# EAGLE design Line Follower (EAGLE 6.1)
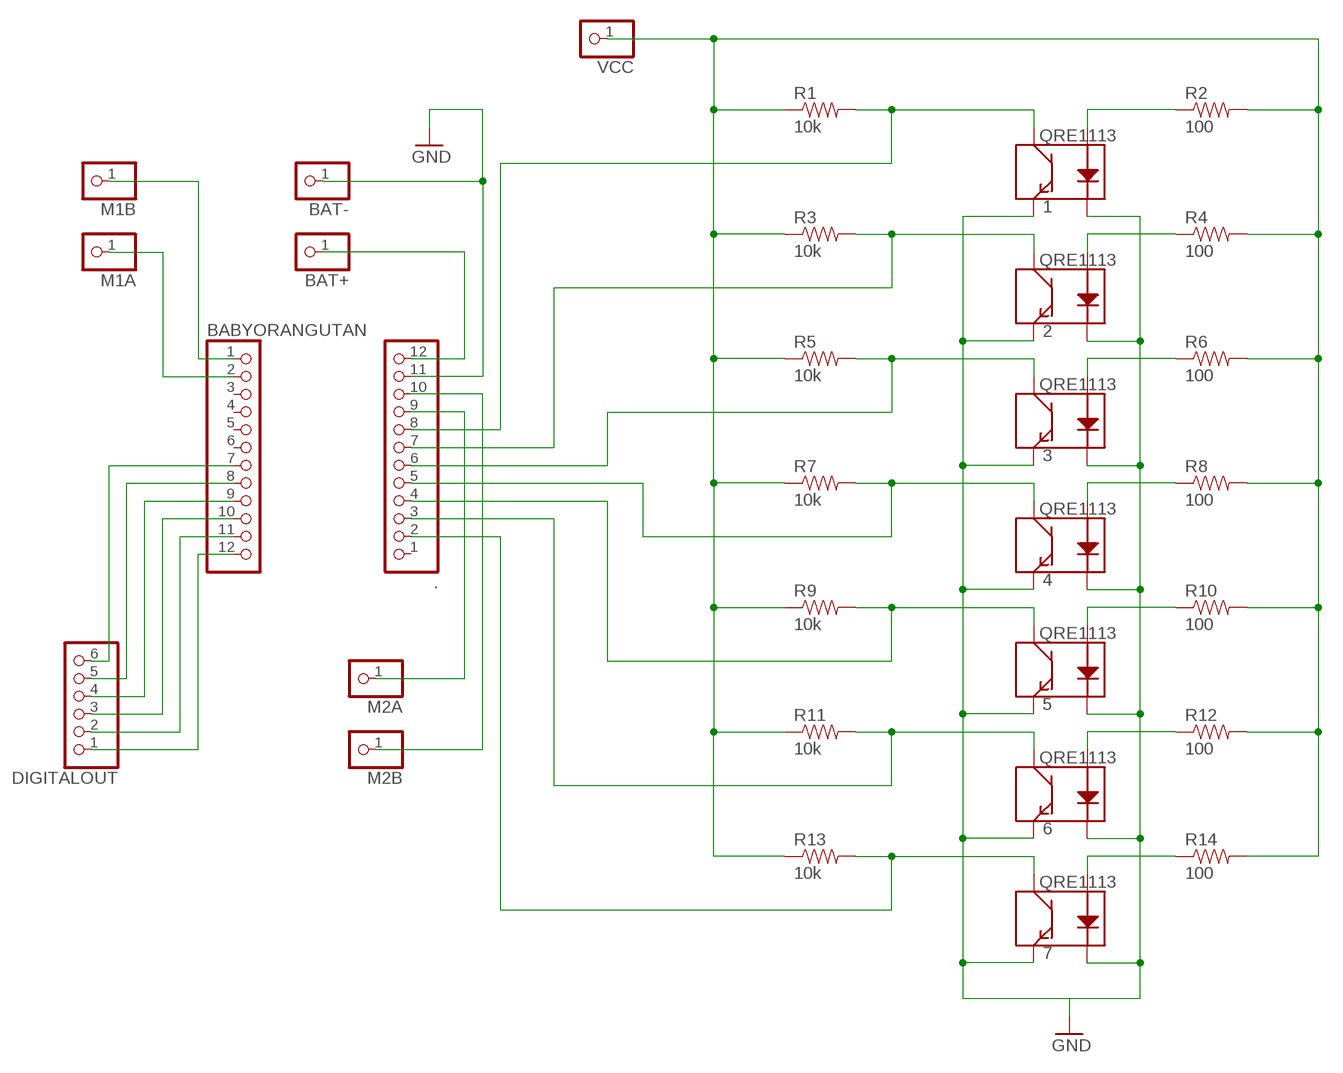
[diagram p0: schematic, sheet 1]

## Parts
1  QRE1113  [QRE1113]
2  QRE1113  [QRE1113]
3  QRE1113  [QRE1113]
4  QRE1113  [QRE1113]
5  QRE1113  [QRE1113]
6  QRE1113  [QRE1113]
7  QRE1113  [QRE1113]
.  PINHD-1X12  [1X12]
BABYORANGUTAN  PINHD-1X12  [1X12]
BAT+  PINHD-1X1  [1X01]
BAT-  PINHD-1X1  [1X01]
DIGITALOUT  PINHD-1X6  [1X06]
M1A  PINHD-1X1  [1X01]
M1B  PINHD-1X1  [1X01]
M2A  PINHD-1X1  [1X01]
M2B  PINHD-1X1  [1X01]
R1  10k  RESISTOR0603-RES  [0603-RES]
R2  100  RESISTOR0805-RES  [0805]
R3  10k  RESISTOR0603-RES  [0603-RES]
R4  100  RESISTOR0805-RES  [0805]
R5  10k  RESISTOR0603-RES  [0603-RES]
R6  100  RESISTOR0805-RES  [0805]
R7  10k  RESISTOR0603-RES  [0603-RES]
R8  100  RESISTOR0805-RES  [0805]
R9  10k  RESISTOR0603-RES  [0603-RES]
R10  100  RESISTOR0805-RES  [0805]
R11  10k  RESISTOR0603-RES  [0603-RES]
R12  100  RESISTOR0805-RES  [0805]
R13  10k  RESISTOR0603-RES  [0603-RES]
R14  100  RESISTOR0805-RES  [0805]
VCC  PINHD-1X1  [1X01]

## Nets
GND: 1.2(K) 1.4(E) 2.2(K) 2.4(E) 3.2(K) 3.4(E) 4.2(K) 4.4(E) 5.2(K) 5.4(E) 6.2(K) 6.4(E) 7.2(K) 7.4(E) ..11 BAT-.1
N$1: 1.3(C) ..8 R1.2
N$4: 4.3(C) ..5 R7.2
N$5: ..12 BAT+.1
N$6: BABYORANGUTAN.7 DIGITALOUT.6
N$7: BABYORANGUTAN.8 DIGITALOUT.5
N$8: 1.1(A) R2.1
N$9: 2.1(A) R4.1
N$10: 3.1(A) R6.1
N$11: 4.1(A) R8.1
N$12: 5.1(A) R10.1
N$13: 6.1(A) R12.1
N$14: 7.1(A) R14.1
N$15: R1.1 R2.2 R3.1 R4.2 R5.1 R6.2 R7.1 R8.2 R9.1 R10.2 R11.1 R12.2 R13.1 R14.2 VCC.1
N$16: BABYORANGUTAN.9 DIGITALOUT.4
N$17: BABYORANGUTAN.10 DIGITALOUT.3
N$18: 2.3(C) ..7 R3.2
N$19: BABYORANGUTAN.11 DIGITALOUT.2
N$20: BABYORANGUTAN.12 DIGITALOUT.1
N$22: 3.3(C) ..6 R5.2
N$25: BABYORANGUTAN.1 M1B.1
N$26: BABYORANGUTAN.2 M1A.1
N$27: ..9 M2A.1
N$28: ..10 M2B.1
N$31: 5.3(C) ..4 R9.2
N$32: 6.3(C) ..3 R11.2
N$34: 7.3(C) ..2 R13.2
Unconnected: ..1 BABYORANGUTAN.3 BABYORANGUTAN.4 BABYORANGUTAN.5 BABYORANGUTAN.6

## Library data of the parts
1-7 = SparkFun:QRE1113
. BABYORANGUTAN = adafruit:PINHD-1X12: PIN HEADER
BAT+ BAT- M1A M1B M2A M2B VCC = adafruit:PINHD-1X1: Pin header 1x1 for 0.1" spacing With round pins
DIGITALOUT = adafruit:PINHD-1X6: PIN HEADER
R1-R14 = SparkFun:RESISTOR: Resistor Basic schematic elements and footprints for 0603, 1206, and PTH resistors.

## Board
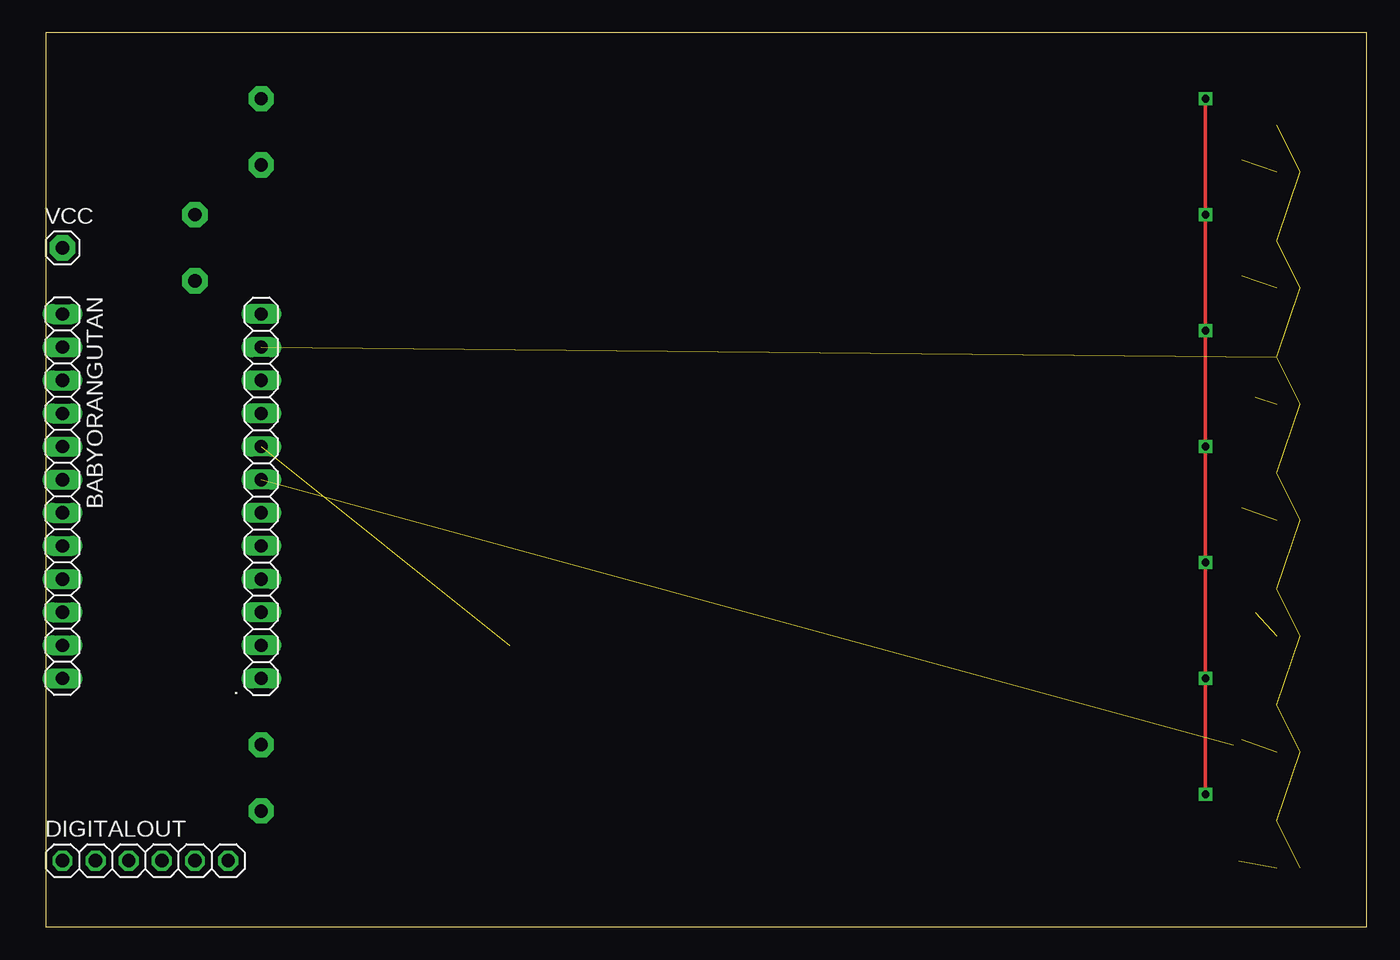
[diagram p1: board, top side]
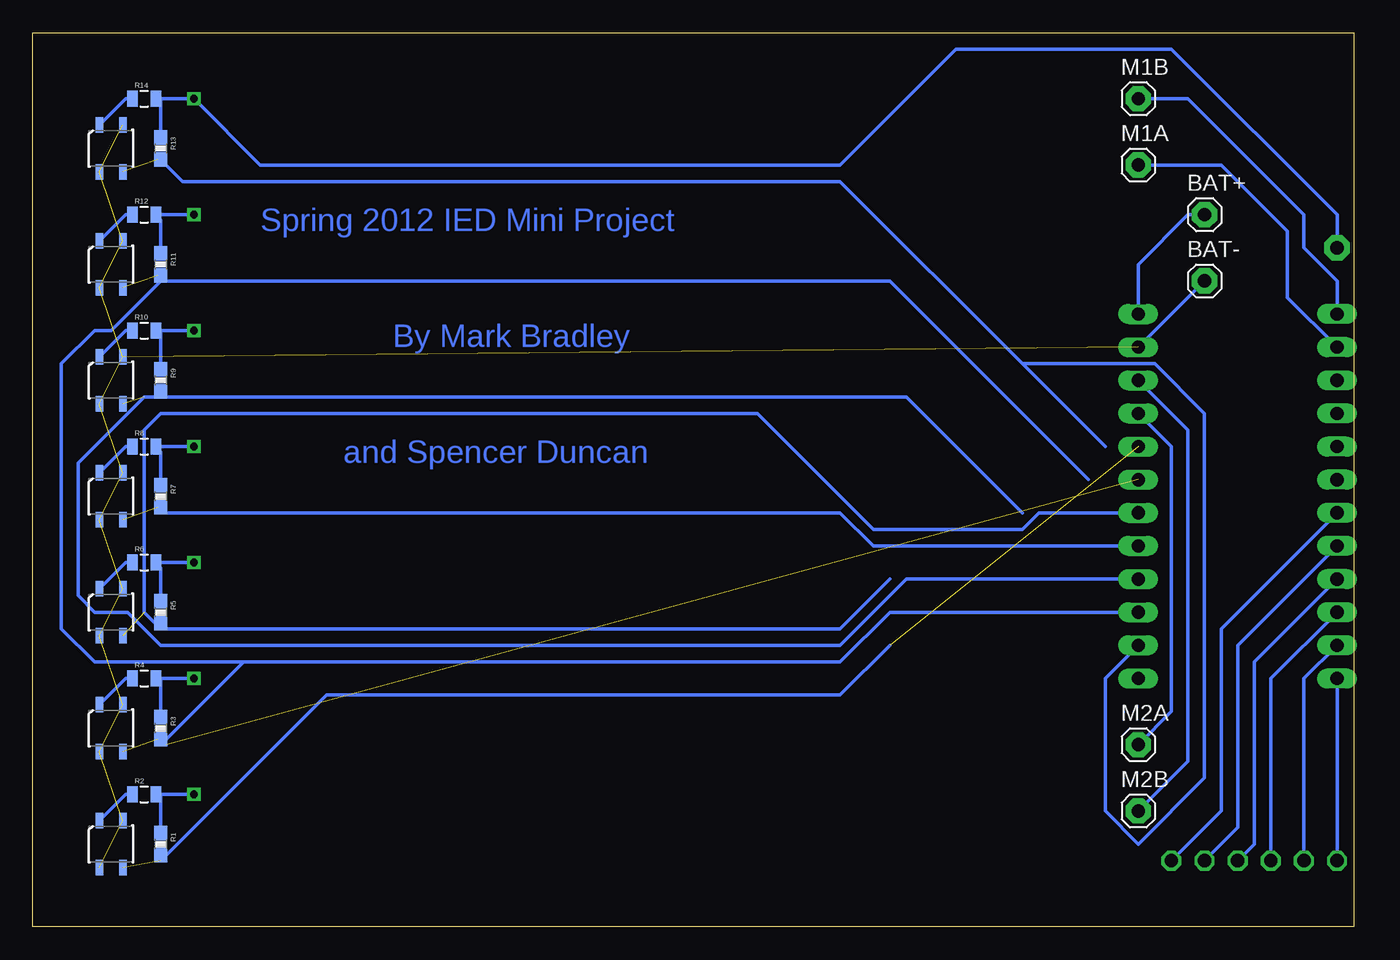
[diagram p2: board, bottom side, seen from below]

Size 101.27 x 68.57 mm. Coordinates in mm from the lower left corner, seen from the top.
Outline: 0,0 101.27,0 101.27,68.57 0,68.57 0,0
Copper layers (1*16): Top 0.035mm / dielectric 1.5mm / Bottom 0.035mm
Design rules: minimum track width 10mil, minimum drill 24mil, track to track 8mil, track to pad 8mil, pad to pad 8mil, via to via 8mil, smd to smd 8mil, copper to edge 40mil, drill to drill 8mil, minimum pad ring 10mil, minimum via ring 8mil, stop-mask expansion 4mil, vias tented up to drill 0mil, thermal gap 10mil

### Footprints (pad centres in the part's own frame; a part is rotated, then mirrored left to right if it is on the bottom)
QRE1113 = smd 1.2 x 0.6: 1 -1.8,-0.9; 2 1.8,-0.9; 3 1.8,0.9; 4 -1.8,0.9
1X12 = drill 1.016 long: 1 -13.97,0; 2 -11.43,0; 3 -8.89,0; 4 -6.35,0; 5 -3.81,0; 6 -1.27,0; 7 1.27,0; 8 3.81,0; 9 6.35,0; 10 8.89,0; 11 11.43,0; 12 13.97,0
1X01 = drill 1.016 pad 1.93 octagon: 1 0,0
1X06 = drill 1.016 octagon: 1 -6.35,0; 2 -3.81,0; 3 -1.27,0; 4 1.27,0; 5 3.81,0; 6 6.35,0
0603-RES = smd 1.1 x 1: 1 -0.85,0; 2 0.85,0
0805 = smd 0.8 x 1.2: 1 -0.9,0; 2 0.9,0

### Placement (x,y rotation side)
1  95.25,6.35 270 bottom
2  95.25,15.24 270 bottom
3  95.25,24.13 270 bottom
4  95.25,33.02 270 bottom
5  95.25,41.91 270 bottom
6  95.25,50.8 270 bottom
7  95.25,59.69 270 bottom
.  16.51,33.02 90 top
BABYORANGUTAN  1.27,33.02 270 top
BAT+  11.43,54.61 0 bottom
BAT-  11.43,49.53 0 bottom
DIGITALOUT  7.62,5.08 0 top
M1A  16.51,58.42 0 bottom
M1B  16.51,63.5 0 bottom
M2A  16.51,13.97 0 bottom
M2B  16.51,8.89 0 bottom
R1  91.44,6.35 270 bottom
R2  92.71,10.16 0 bottom
R3  91.44,15.24 270 bottom
R4  92.71,19.05 0 bottom
R5  91.44,24.13 270 bottom
R6  92.71,27.94 0 bottom
R7  91.44,33.02 270 bottom
R8  92.71,36.83 0 bottom
R9  91.44,41.91 270 bottom
R10  92.71,45.72 0 bottom
R11  91.44,50.8 270 bottom
R12  92.71,54.61 0 bottom
R13  91.44,59.69 270 bottom
R14  92.71,63.5 0 bottom
VCC  1.27,52.07 0 top

### Tracks (layer width: path | path; a pad name or v marks a point on that pad's centre or on a via)
GND  (14 unrouted)
  Bottom 0.254: BAT-.1 ..11
N$1  (2 unrouted)
  Bottom 0.254: R1.2 91.44,5.08 78.74,17.78 39.37,17.78 35.56,21.59
N$4  (1 unrouted)
  Bottom 0.254: ..5 36.83,29.21 39.37,31.75 91.44,31.75 R7.2 91.7,32.17
N$5
  Bottom 0.254: BAT+.1 12.7,54.61 16.51,50.8 ..12
N$6
  Bottom 0.254: DIGITALOUT.6 10.16,8.89 10.16,22.86 BABYORANGUTAN.7
N$7
  Bottom 0.254: BABYORANGUTAN.8 8.89,21.59 8.89,7.62 DIGITALOUT.5
N$8
  Bottom 0.254: R2.1 94.14,10.16 1.1
N$9
  Bottom 0.254: R4.1 94.14,19.05 2.1
N$10
  Bottom 0.254: R6.1 94.14,27.94 3.1
N$11
  Bottom 0.254: R8.1 94.14,36.83 4.1
N$12
  Bottom 0.254: R10.1 94.14,45.72 5.1
N$13
  Bottom 0.254: R12.1 94.14,54.61 6.1
N$14
  Bottom 0.254: R14.1 94.14,63.5 7.1
N$15  (via drill 0.6)
  Top 0.254: v88.9,10.16 v88.9,19.05 v88.9,27.94 v88.9,36.83 v88.9,45.72 v88.9,54.61 v88.9,63.5
  Bottom 0.254: 91.44,10.16 R1.1 | 91.44,10.16 R2.2 | 91.44,63.5 v88.9,63.5 83.82,58.42 39.37,58.42 30.48,67.31 13.97,67.31 1.27,54.61 VCC.1 | v88.9,54.61 R12.2 91.44,54.19 R11.1 | R10.2 91.44,45.72 | 91.44,45.72 v88.9,45.72 | R9.1 91.44,45.72 | v88.9,36.83 R8.2 91.44,36.41 R7.1 | v88.9,27.94 R6.2 91.44,27.52 R5.1 | R4.2 91.44,19.05 | 91.44,19.05 v88.9,19.05 | R3.1 91.44,19.05 | 91.44,10.16 v88.9,10.16 | R13.1 91.44,63.5 | 91.44,63.5 R14.2
N$16
  Bottom 0.254: BABYORANGUTAN.9 7.62,20.32 7.62,6.35 DIGITALOUT.4
N$17
  Bottom 0.254: BABYORANGUTAN.10 6.35,19.05 DIGITALOUT.3
N$18  (2 unrouted)
  Bottom 0.254: 91.7,14.39 R3.2 91.02,13.97
N$19
  Bottom 0.254: DIGITALOUT.2 3.81,19.05 BABYORANGUTAN.11
N$20
  Bottom 0.254: BABYORANGUTAN.12 DIGITALOUT.1
N$22  (1 unrouted)
  Bottom 0.254: R5.2 91.7,23.28 | R5.2 91.02,22.86 39.37,22.86 35.56,26.67 | ..6 24.13,31.75 25.4,30.48 36.83,30.48 45.72,39.37 91.44,39.37 92.71,38.1 92.71,24.13 91.44,22.86 R5.2
N$25
  Bottom 0.254: BABYORANGUTAN.1 1.27,49.53 3.81,52.07 3.81,54.61 12.7,63.5 M1B.1
N$26
  Bottom 0.254: BABYORANGUTAN.2 5.08,48.26 5.08,53.34 10.16,58.42 M1A.1
N$27
  Bottom 0.254: ..9 13.97,36.83 13.97,16.51 M2A.1
N$28
  Bottom 0.254: ..10 12.7,38.1 12.7,12.7 M2B.1
N$31  (1 unrouted)
  Bottom 0.254: 91.7,41.06 R9.2 91.44,40.64 | 91.44,40.64 34.29,40.64 25.4,31.75 | ..4 34.29,26.67 39.37,21.59 91.44,21.59 93.98,24.13 96.52,24.13 97.79,25.4 97.79,35.56 92.71,40.64 91.44,40.64
N$32  (1 unrouted)
  Bottom 0.254: ..3 35.56,24.13 39.37,20.32 85.09,20.32 | 85.09,20.32 91.44,13.97 | 91.7,49.95 R11.2 91.44,49.53 | 91.44,49.53 35.56,49.53 20.32,34.29 | 91.44,49.53 95.25,45.72 96.52,45.72 99.06,43.18 99.06,22.86 96.52,20.32 85.09,20.32
N$34  (1 unrouted)
  Bottom 0.254: R13.2 91.7,58.84 | 91.02,58.42 R13.2 | R13.2 89.75,57.15 39.37,57.15 25.4,43.18 | 19.05,36.83 25.4,43.18 | ..2 19.05,19.05 19.05,8.89 16.51,6.35 11.43,11.43 11.43,39.37 15.24,43.18 25.4,43.18

### Text on the board
Bottom: Spring 2012 IED Mini Project | By Mark Bradley | and Spencer Duncan